# EasyEDA Pro project 半桥+驱动器.eprj

# Schematic Schematic1
Board Name: Board1; Create Date: 2025-04-12
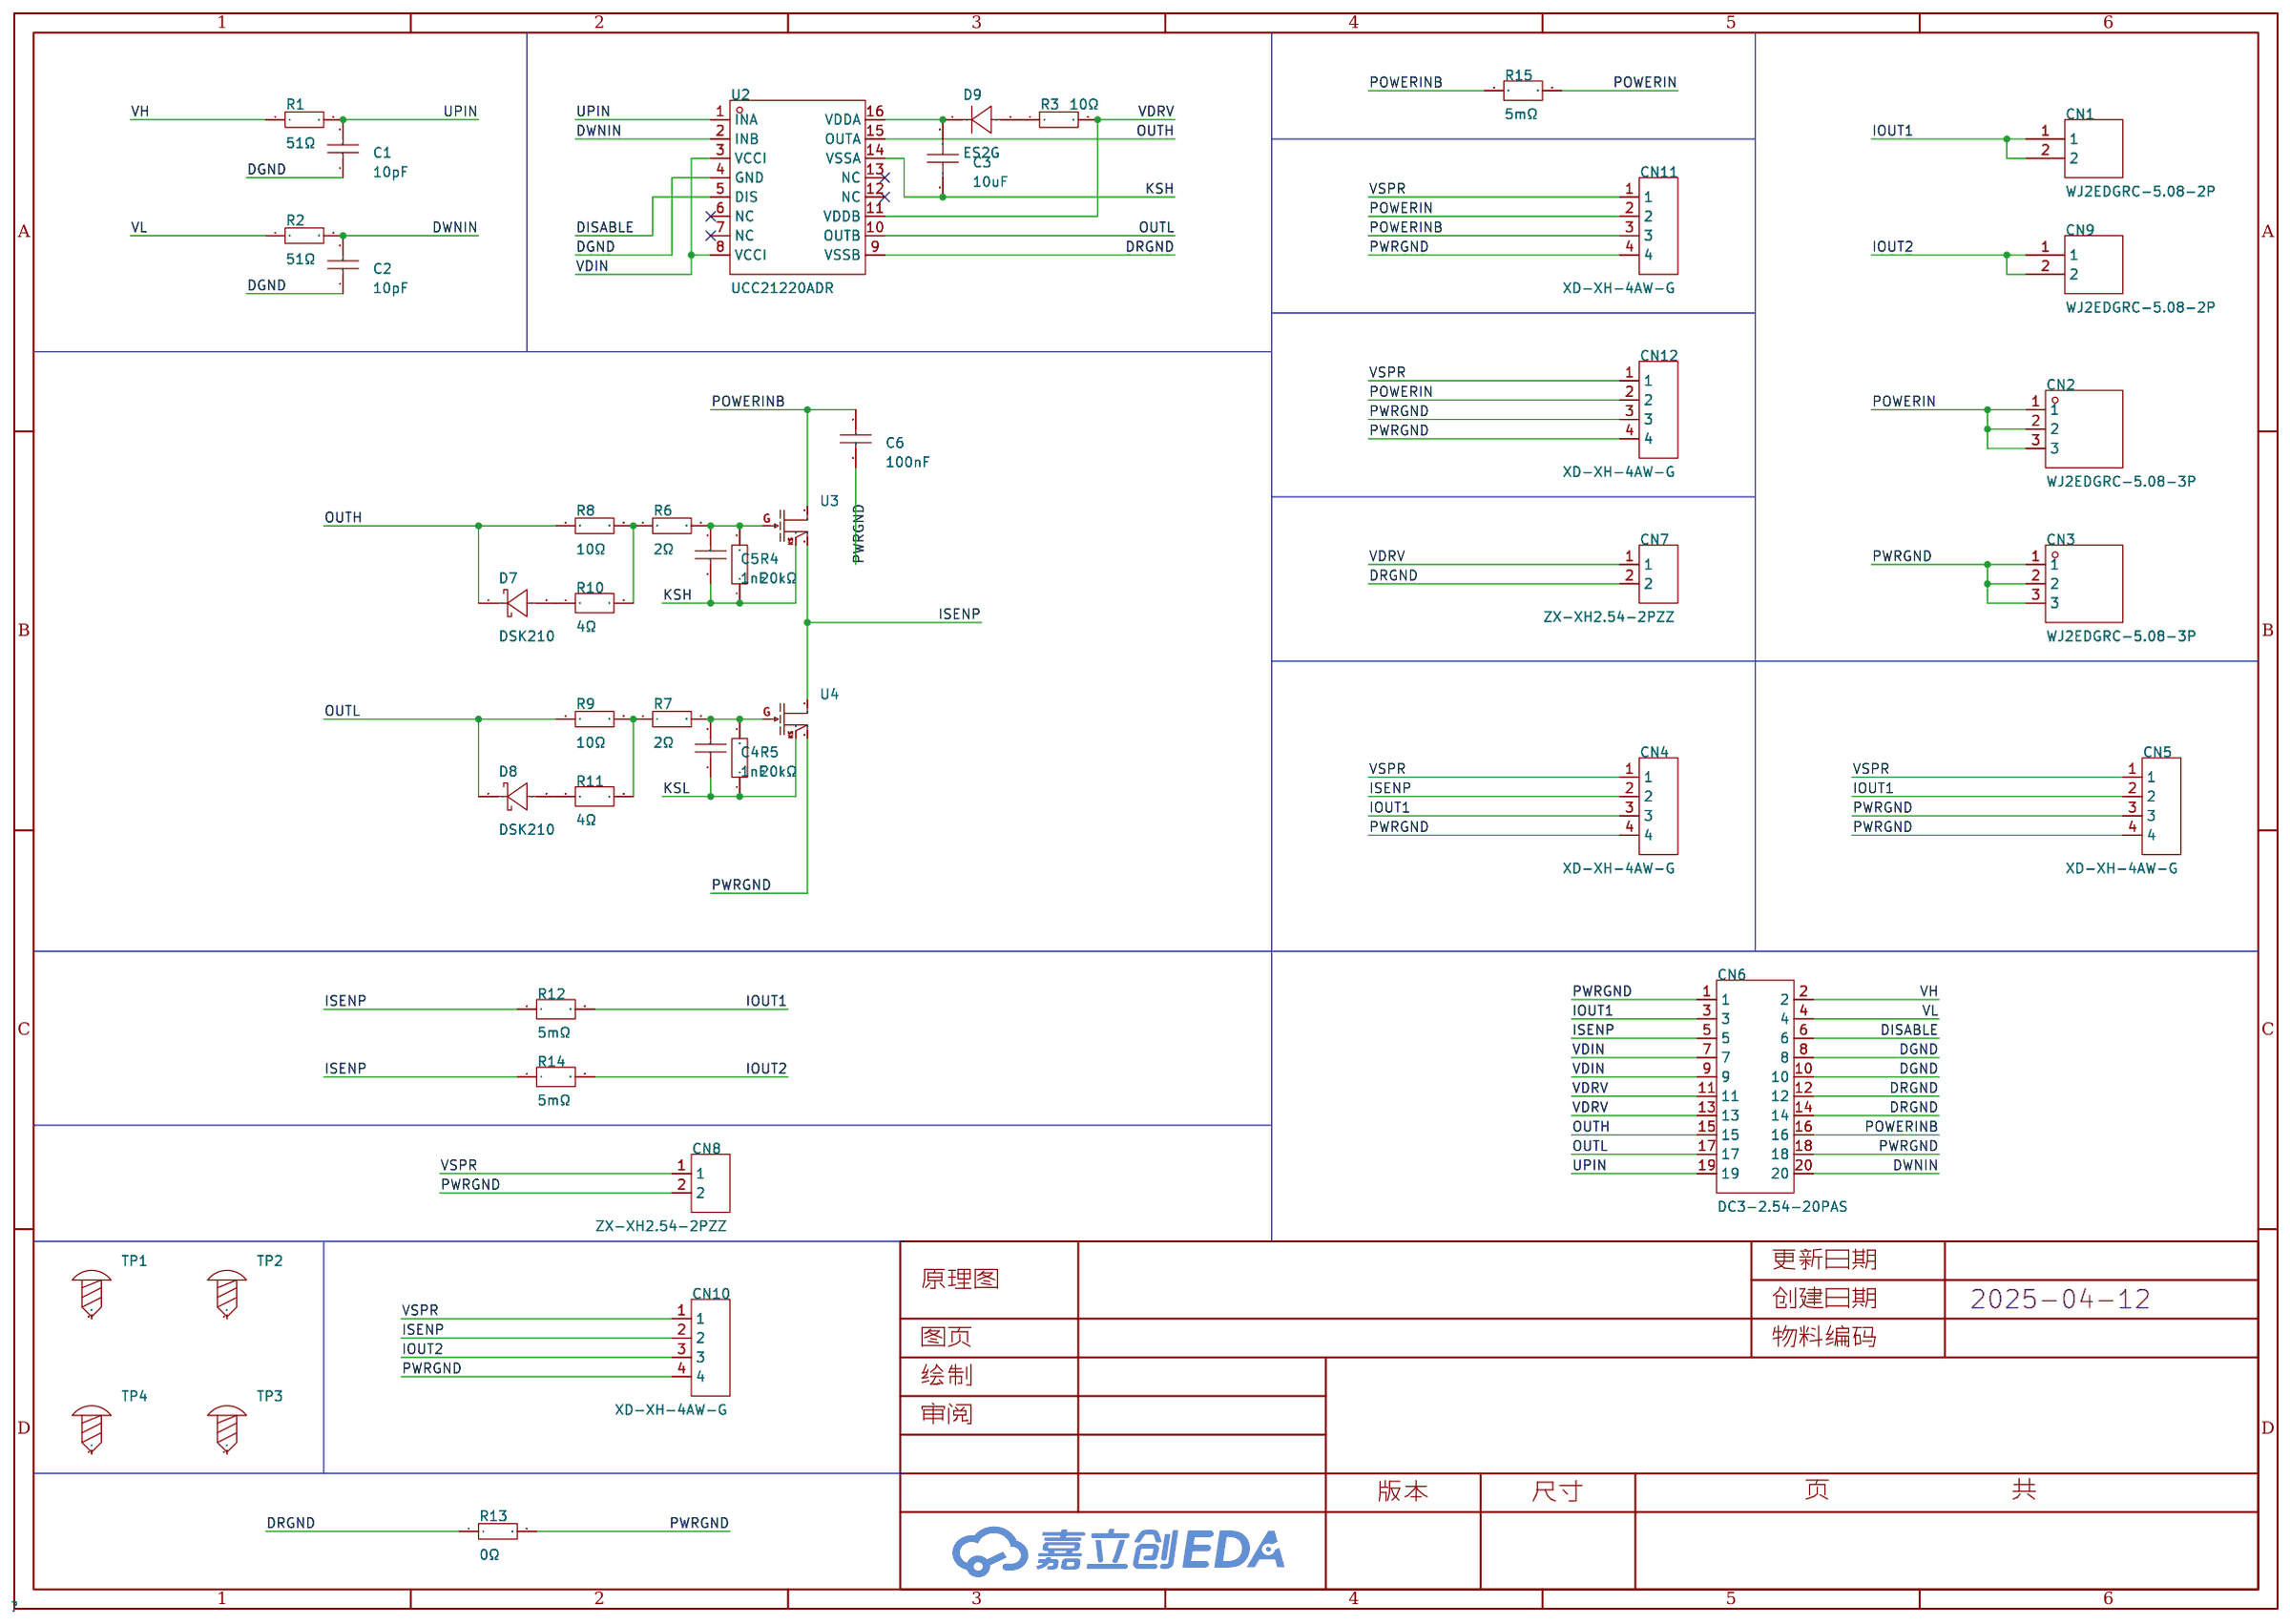
[diagram p0: schematic sheet]

## Parts
C1  10pF  [C0603]
C2  10pF  [C0603]
C3  10uF  [C0805]
C4  1nF  [C0603]
C5  1nF  [C0603]
C6  100nF  [C1210]
CN1  WJ2EDGRC-5.08-2P  [CONN-TH_2P-P5.08_WJ2EDGRC-5.08-2P]
CN2  WJ2EDGRC-5.08-3P  [CONN-TH_3P-P5.08_WJ2EDGRC-5.08-3P]
CN3  WJ2EDGRC-5.08-3P  [CONN-TH_3P-P5.08_WJ2EDGRC-5.08-3P]
CN4  XD-XH-4AW-G  [CONN-TH_XD-XH-4AW-G]
CN5  XD-XH-4AW-G  [CONN-TH_XD-XH-4AW-G]
CN6  DC3-2.54-20PAS  [HDR-TH_20P-P2.54_DC3-2.54-20PAS]
CN7  ZX-XH2.54-2PZZ  [CONN-TH_2P-P2.50_HX25003-2A]
CN8  ZX-XH2.54-2PZZ  [CONN-TH_2P-P2.50_HX25003-2A]
CN9  WJ2EDGRC-5.08-2P  [CONN-TH_2P-P5.08_WJ2EDGRC-5.08-2P]
CN10  XD-XH-4AW-G  [CONN-TH_XD-XH-4AW-G]
CN11  XD-XH-4AW-G  [CONN-TH_XD-XH-4AW-G]
CN12  XD-XH-4AW-G  [CONN-TH_XD-XH-4AW-G]
D7  DSK210  [SOD-123FL_L2.7-W1.8-LS3.8-RD]
D8  DSK210  [SOD-123FL_L2.7-W1.8-LS3.8-RD]
D9  ES2G  [SMA_L4.3-W2.6-LS5.0-RD]
R1  51Ω  [R0603]
R2  51Ω  [R0603]
R3  10Ω  [R0805_NEW]
R4  20kΩ  [R0603]
R5  20kΩ  [R0603]
R6  2Ω  [R0603]
R7  2Ω  [R0603]
R8  10Ω  [R0603]
R9  10Ω  [R0603]
R10  4Ω  [R0603]
R11  4Ω  [R0603]
R12  5mΩ  [RES-SMD_L6.4-W3.2-1]
R13  0Ω  [R0805]
R14  5mΩ  [RES-SMD_L6.4-W3.2-1]
R15  5mΩ  [RES-SMD_L6.4-W3.2-1]
TP1  -  [M3螺丝]
TP2  -  [M2螺丝]
TP3  -  [M2螺丝]
TP4  -  [M3螺丝]
U2  UCC21220ADR  [SOIC-16_L9.9-W3.9-P1.27-LS6.0-BL]
U3  -  [INN650TA030AH]
U4  -  [INN650TA030AH]

## Library data of the parts
C1 C2 = CC0603JRNPO9BN100: 容值:10pF;精度:±5%;额定电压:50V;材质(温度系数):NP0;; LCSC Part Name: 10pF ±5% 50V; Supplier Part: C106245; Manufacturer: YAGEO(国巨); Supplier Footprint: 0603; JLCPCB Part Class: 扩展库; Datasheet: https://atta.szlcsc.com/upload/public/pdf/source/20170505/1493957838062.pdf; Supplier: LCSC; Tolerance: ±5%; Voltage Rated: 50V; Temperature Coefficient: NP0
C3 = CL21A106KAYNNNE_C15850: 容值:10uF;精度:±10%;额定电压:25V;材质(温度系数):X5R;; LCSC Part Name: 10uF ±10% 25V; Supplier Part: C15850; Manufacturer: SAMSUNG(三星); Manufacturer Part: CL21A106KAYNNNE; Supplier Footprint: 0805; JLCPCB Part Class: 基础库; Datasheet: https://atta.szlcsc.com/upload/public/pdf/source/20160218/1457707763339.pdf; Supplier: LCSC; Tolerance: ±10%; Voltage Rated: 25V; Temperature Coefficient: X5R
C4 C5 = CL10B102KB8NNNC: LCSC Part Name: 1nF ±10% 50V; Supplier Part: C1588; Manufacturer: SAMSUNG(三星); Supplier Footprint: 0603; JLCPCB Part Class: 基础库; Datasheet: https://atta.szlcsc.com/upload/public/pdf/source/20160218/1457707763339.pdf; Supplier: LCSC; Tolerance: ±10%; Voltage Rated: 50V; Temperature Coefficient: X7R
C6 = C1210X104M351T: LCSC Part Name: 100nF ±20% 350V; Supplier Part: C106105; Manufacturer: IHHEC(禾伸堂); Supplier Footprint: 1210; JLCPCB Part Class: 扩展库; Datasheet: https://atta.szlcsc.com/upload/public/pdf/source/20200117/C485772_1C2A03D89DC7D3F931FB9AFBA2903E68.pdf; Supplier: LCSC; Tolerance: ±20%; Voltage Rating: 350V; Temperature Coefficient: X7R
CN1 CN9 = WJ2EDGRC-5.08-2P: 连接器类型:板端/插座-闭口;固定方式:-;结构:1x2P;间距:5.08mm;颜色:绿色;安装方式:弯针;排数:1;每排PIN数:2;额定电流:20A;额定电压:450V;线规 - AWG:-;线规 - 平方毫米:-;触头材质:黄铜;触头镀层:锡;工作温度范围:-40℃~+105℃;焊接温度(最大值):-;; LCSC Part Name: 1x2P 5.08mm 排数:1 每排P数:2; Supplier Part: C3697; Manufacturer: KANGNEX(康奈克斯电气); Supplier Footprint: 弯插,P=5.08mm; JLCPCB Part Class: 扩展库; Datasheet: https://atta.szlcsc.com/upload/public/pdf/source/20240813/4D8AF133EBD88DD18E5AA0CE5EC77AA3.pdf; Supplier: LCSC; Connector Type: 板端/插座-闭口; Structure: 1x2P; Pitch: 5.08mm; Color: 绿色; Mounting Style: 弯针; Number of Pins: 2P; Number of Rows: 1; Number of PINs Per Row: 2; Current Rating (Max): 20A; Voltage Rating (Max): 450V; Contact Material: 黄铜; Contact Plating: 锡; Operating Temperature Range: -40℃~+105℃
CN2 CN3 = WJ2EDGRC-5.08-3P: 连接器类型:板端/插座-闭口;固定方式:-;结构:1x3P;间距:5.08mm;颜色:绿色;安装方式:弯针;排数:1;每排PIN数:3;额定电流:20A;额定电压:450V;线规 - AWG:-;线规 - 平方毫米:-;触头材质:黄铜;触头镀层:锡;工作温度范围:-40℃~+105℃;焊接温度(最大值):-;; LCSC Part Name: 1x3P 5.08mm 排数:1 每排P数:3; Supplier Part: C8377; Manufacturer: KANGNEX(康奈克斯电气); Supplier Footprint: 弯插,P=5.08mm; JLCPCB Part Class: 扩展库; Datasheet: https://atta.szlcsc.com/upload/public/pdf/source/20240813/4D8AF133EBD88DD18E5AA0CE5EC77AA3.pdf; Supplier: LCSC; Connector Type: 板端/插座-闭口; Structure: 1x3P; Pitch: 5.08mm; Color: 绿色; Mounting Style: 弯针; Number of Pins: 3P; Number of Rows: 1; Number of PINs Per Row: 3; Current Rating (Max): 20A; Voltage Rating (Max): 450V; Contact Material: 黄铜; Contact Plating: 锡; Operating Temperature Range: -40℃~+105℃
CN4 CN5 CN10-CN12 = XD-XH-4AW-G: 插针结构:1x4P;间距:2.54mm;安装方式:弯插;参考系列:XH;总PIN数:4P;排数:1;每排PIN数:4;行距:2.54mm;额定电流:3A;工作温度:-25℃~+85℃;; LCSC Part Name: 1x4P 间距:2.54mm 弯插 系列:XH; Supplier Part: C17700963; Manufacturer: XUNDA(讯答); Supplier Footprint: 插件,P=2.5mm; JLCPCB Part Class: 扩展库; Datasheet: https://atta.szlcsc.com/upload/public/pdf/source/20231019/EDD688933EF3B2A2948A0AD0307CAFB3.pdf; Supplier: LCSC; Pins Structure: 1x4P; Pitch: 2.54mm; Mounting Type: 弯插; Reference Series: XH; Number of Pins: 4P; Number of Rows: 1; Number of PINs Per Row: 4; Row Spacing: 2.54mm; Current Rating: 3A; Operating Temperature: -25℃~+85℃
CN6 = DC3-2.54-20PAS: 连接器类型:简牛座;间距:2.54mm;结构:2x10P;额定电流:1.5A;额定电压:-;封装形式:直插;行距:2.54mm;排数:2;每排PIN数:10;工作温度范围:-40℃~+105℃;; LCSC Part Name: 2.54mm 2x10P 排数:2 每排P数:10; Supplier Part: C2977593; Manufacturer: ZHOURI(洲日); Supplier Footprint: 插件,P=2.54mm; JLCPCB Part Class: 扩展库; Datasheet: https://atta.szlcsc.com/upload/public/pdf/source/20220323/3AE71E35B6CB94868980D8F0E3C5785B.pdf; Supplier: LCSC; Connector Type: 简牛座; Pitch: 2.54mm; Structure: 2x10P; Current Rating (Max): 1.5A; Holder Type: 直插; Row Spacing: 2.54mm; Number of Rows: 2; Pin Number in each Row: 10; Operating Temperature Range: -40℃~+105℃
CN7 CN8 = ZX-XH2.54-2PZZ: 插针结构:1x2P;间距:2.5mm;安装方式:直插;参考系列:XH;总PIN数:2P;排数:1;每排PIN数:2;行距:-;额定电流:3A;触头材质:黄铜;触头镀层:锡;工作温度范围:-25℃~+85℃;; LCSC Part Name: 1x2P 间距:2.5mm 直插 系列:XH; Supplier Part: C7429632; Manufacturer: Megastar(兆星); Supplier Footprint: 插件,P=2.5mm; JLCPCB Part Class: 扩展库; Datasheet: https://atta.szlcsc.com/upload/public/pdf/source/20230619/19BA6947230AA44A04D3EDD65E618FD0.pdf; Supplier: LCSC; Pins Structure: 1x2P; Pitch: 2.5mm; Mounting Type: 直插; Reference Series: XH; Number of Pins: 2P; Number of Rows: 1; Number of PINs Per Row: 2; Rated Current: 3A; Contact Material: 黄铜; Contact Plating: 锡; Operating Temperature: -25℃~+85℃; Rated Voltage (Max): 250V; Plastic Material: PA66; Flame Retardant Rating: UL94V-0; Color: 白色; Z-Height of the Board: 7mm; X-Length of Bottom Edge on Board (Spacing Line): 7.5mm; Y-Width of Bottom Edge on Board: 5.9mm
D7 D8 = DSK210_C7502713: LCSC Part Name: 电压:100V 电流:2A; Supplier Part: C7502713; Manufacturer: 宏迦橙; Supplier Footprint: SOD-123FL; JLCPCB Part Class: 扩展库; Datasheet: https://atta.szlcsc.com/upload/public/pdf/source/20240814/18366EFEA8C1355349286254791BE851.pdf; Supplier: LCSC; Diode Configuration: 独立式; Forward Voltage (Vf@If): 850mV@2A; Reverse Voltage (Vr): 100V; Rectified Current: 2A; Reverse Leakage Current (Ir): 500uA
D9 = ES2G_C18199140: Supplier Part: C18199140; Manufacturer: 宏嘉诚; Supplier Footprint: SMA(DO-214AC); JLCPCB Part Class: 扩展库; Datasheet: https://atta.szlcsc.com/upload/public/pdf/source/20250205/BC13E6E0AE5DD1ED200D851F3F85D0E7.pdf; Supplier: LCSC; Diode Configuration: 独立式; Voltage - Forward(Vf@If): 1.3V@2A; Voltage - DC Reverse(Vr): 400V; Current - Rectified: 2A; Reverse Leakage Current (Ir): 2uA@400V; Reverse Recovery Time (trr): 35ns; Operating Temperature: -55℃~+150℃
R1 R2 = 0603WAF510JT5E: 电阻类型:厚膜电阻;阻值:51Ω;精度:±1%;功率:100mW;最大工作电压:75V;温度系数:±100ppm/℃;; LCSC Part Name: 51Ω ±1% 100mW 厚膜电阻; Supplier Part: C23197; Manufacturer: UNI-ROYAL(厚声); Supplier Footprint: 0603; JLCPCB Part Class: 基础库; Datasheet: https://atta.szlcsc.com/upload/public/pdf/source/20200306/C422600_1E6D84923E4A46A82E41ADD87F860B5C.pdf; Supplier: LCSC; Type: 厚膜电阻; Tolerance: ±1%; Power(Watts): 100mW; Overload Voltage (Max): 75V; Temperature Coefficient: ±100ppm/℃; Operating Temperature Range: -55℃~+155℃
R3 = 0805W8F100JT5E: 电阻类型:厚膜电阻;阻值:10Ω;精度:±1%;功率:125mW;最大工作电压:150V;温度系数:±200ppm/℃;; LCSC Part Name: 10Ω ±1% 125mW 厚膜电阻; Supplier Part: C17415; Manufacturer: UNI-ROYAL(厚声); Supplier Footprint: 0805; JLCPCB Part Class: 基础库; Datasheet: https://atta.szlcsc.com/upload/public/pdf/source/20200306/C422600_1E6D84923E4A46A82E41ADD87F860B5C.pdf; Supplier: LCSC; Type: 厚膜电阻; Tolerance: ±1%; Power(Watts): 125mW; Overload Voltage (Max): 150V; Temperature Coefficient: ±200ppm/℃; Operating Temperature Range: -55℃~+155℃
R4 R5 = 0603WAF2002T5E: 电阻类型:厚膜电阻;阻值:20kΩ;精度:±1%;功率:100mW;最大工作电压:75V;温度系数:±100ppm/℃;; LCSC Part Name: 20kΩ ±1% 100mW 厚膜电阻; Supplier Part: C4184; Manufacturer: UNI-ROYAL(厚声); Supplier Footprint: 0603; JLCPCB Part Class: 基础库; Datasheet: https://atta.szlcsc.com/upload/public/pdf/source/20200306/C422600_1E6D84923E4A46A82E41ADD87F860B5C.pdf; Supplier: LCSC; Type: 厚膜电阻; Tolerance: ±1%; Power(Watts): 100mW; Overload Voltage (Max): 75V; Temperature Coefficient: ±100ppm/℃; Operating Temperature Range: -55℃~+155℃
R6 R7 = 0603WAF200KT5E: 电阻类型:厚膜电阻;阻值:2Ω;精度:±1%;功率:100mW;最大工作电压:75V;温度系数:±200ppm/℃;; LCSC Part Name: 2Ω ±1% 100mW 厚膜电阻; Supplier Part: C22977; Manufacturer: UNI-ROYAL(厚声); Supplier Footprint: 0603; JLCPCB Part Class: 基础库; Datasheet: https://atta.szlcsc.com/upload/public/pdf/source/20200306/C422600_1E6D84923E4A46A82E41ADD87F860B5C.pdf; Supplier: LCSC; Type: 厚膜电阻; Tolerance: ±1%; Power(Watts): 100mW; Overload Voltage (Max): 75V; Temperature Coefficient: ±200ppm/℃; Operating Temperature Range: -55℃~+155℃
R8 R9 = 0603WAF100JT5E: 电阻类型:厚膜电阻;阻值:10Ω;精度:±1%;功率:100mW;最大工作电压:75V;温度系数:±400ppm/℃;; LCSC Part Name: 10Ω ±1% 100mW 厚膜电阻; Supplier Part: C22859; Manufacturer: UNI-ROYAL(厚声); Supplier Footprint: 0603; JLCPCB Part Class: 基础库; Datasheet: https://atta.szlcsc.com/upload/public/pdf/source/20200306/C422600_1E6D84923E4A46A82E41ADD87F860B5C.pdf; Supplier: LCSC; Type: 厚膜电阻; Tolerance: ±1%; Power(Watts): 100mW; Overload Voltage (Max): 75V; Temperature Coefficient: ±400ppm/℃; Operating Temperature Range: -55℃~+155℃
R10 R11 = CR164R00F: 电阻类型:厚膜电阻;阻值:4Ω;精度:±1%;功率:100mW;温度系数:±200ppm/℃;; LCSC Part Name: 厚膜电阻 4Ω ±1% 100mW; Supplier Part: C3942554; Manufacturer: Meritek; Supplier Footprint: 0603; JLCPCB Part Class: 扩展库; Datasheet: https://atta.szlcsc.com/upload/public/pdf/source/20240408/EFC32A6E0B04D07E4D8A435A440C47B4.pdf; Supplier: LCSC; Type: 厚膜电阻; Tolerance: ±1%; Power(Watts): 100mW; Temperature Coefficient: ±200ppm/℃; Operating Temperature: -55℃~+155℃
R12 R14 R15 = HoJLR2512-3W-5mR-1%: 电阻类型:采样电阻;阻值:5mΩ;精度:±1%;功率:3W;安装方式:贴片;; LCSC Part Name: 5mΩ ±1% 3W; Supplier Part: C2903482; Manufacturer: Milliohm(毫欧); Supplier Footprint: 2512; JLCPCB Part Class: 扩展库; Datasheet: https://atta.szlcsc.com/upload/public/pdf/source/20211009/7525CABAB363C979E942C1DD41F1FEF0.pdf; Supplier: LCSC; Type: 采样电阻; Tolerance: ±1%; Power(Watts): 3W; Mounting Sytle: 贴片
R13 = 0805W8F0000T5E: 电阻类型:厚膜电阻;阻值:0Ω;精度:±1%;功率:125mW;最大工作电压:150V;温度系数:±800ppm/℃;; LCSC Part Name: 0Ω ±1% 125mW 厚膜电阻; Supplier Part: C17477; Manufacturer: UNI-ROYAL(厚声); Supplier Footprint: 0805; JLCPCB Part Class: 基础库; Datasheet: https://atta.szlcsc.com/upload/public/pdf/source/20200306/C422600_1E6D84923E4A46A82E41ADD87F860B5C.pdf; Supplier: LCSC; Type: 厚膜电阻; Tolerance: ±1%; Power(Watts): 125mW; Overload Voltage (Max): 150V; Temperature Coefficient: ±800ppm/℃; Operating Temperature Range: -55℃~+155℃
TP1 TP4 = M3螺丝: Supplier Footprint: 插件
TP2 TP3 = M2螺丝: Supplier Footprint: 插件
U2 = UCC21220ADR: Supplier Part: C2878025; Manufacturer: TI(德州仪器); Supplier Footprint: SOIC-16; JLCPCB Part Class: 扩展库; Datasheet: https://www.ti.com/cn/lit/gpn/ucc21220; Supplier: LCSC
U3 U4 = INN650TA030AH

## Nets
DGND: C1.1 C2.1 CN6.8 CN6.10 U2.4(GND)
DISABLE: CN6.6 U2.5(DIS)
DRGND: CN6.12 CN6.14 CN7.2 R13.1 U2.9(VSSB)
DWNIN: C2.2 CN6.20 R2.2 U2.2(INB)
IOUT1: CN1.1 CN1.2 CN4.3 CN5.2 CN6.3 R12.2
IOUT2: CN9.1 CN9.2 CN10.3 R14.2
ISENP: CN4.2 CN6.5 CN10.2 R12.1 R14.1 U3.S(2) U4.D(1)
KSH: C3.1 C5.1 R4.1 U2.14(VSSA) U3.KS(2)
KSL: C4.1 R5.1 U4.KS(2)
OUTH: CN6.15 D7.1(K) R8.1 U2.15(OUTA)
OUTL: CN6.17 D8.1(K) R9.1 U2.10(OUTB)
POWERIN: CN2.1 CN2.2 CN2.3 CN11.2 CN12.2 R15.2
POWERINB: C6.2 CN6.16 CN11.3 R15.1 U3.D(1)
PWRGND: C6.1 CN3.1 CN3.2 CN3.3 CN4.4 CN5.3 CN5.4 CN6.1 CN6.18 CN8.2 CN10.4 CN11.4 CN12.3 CN12.4 R13.2 U4.S(2)
UPIN: C1.2 CN6.19 R1.2 U2.1(INA)
VDIN: CN6.7 CN6.9 U2.3(VCCI) U2.8(VCCI)
VDRV: CN6.11 CN6.13 CN7.1 R3.2 U2.11(VDDB)
VH: CN6.2 R1.1
VL: CN6.4 R2.1
VSPR: CN4.1 CN5.1 CN8.1 CN10.1 CN11.1 CN12.1
$1N1810: C3.2 D9.1(K) U2.16(VDDA)
$1N1849: C4.2 R5.2 R7.2 U4.G(2)
$1N1850: C5.2 R4.2 R6.2 U3.G(2)
$1N1851: R7.1 R9.2 R11.2
$1N1854: R6.1 R8.2 R10.2
$1N9211: D7.2(A) R10.1
$1N9248: D8.2(A) R11.1
$1N9324: D9.2(A) R3.1

Not connected (* = marked no-connect by the designer): TP1 1; TP2 1; TP3 1; TP4 1; U2 6(NC)* 7(NC)* 12(NC)* 13(NC)*

# Board PCB1
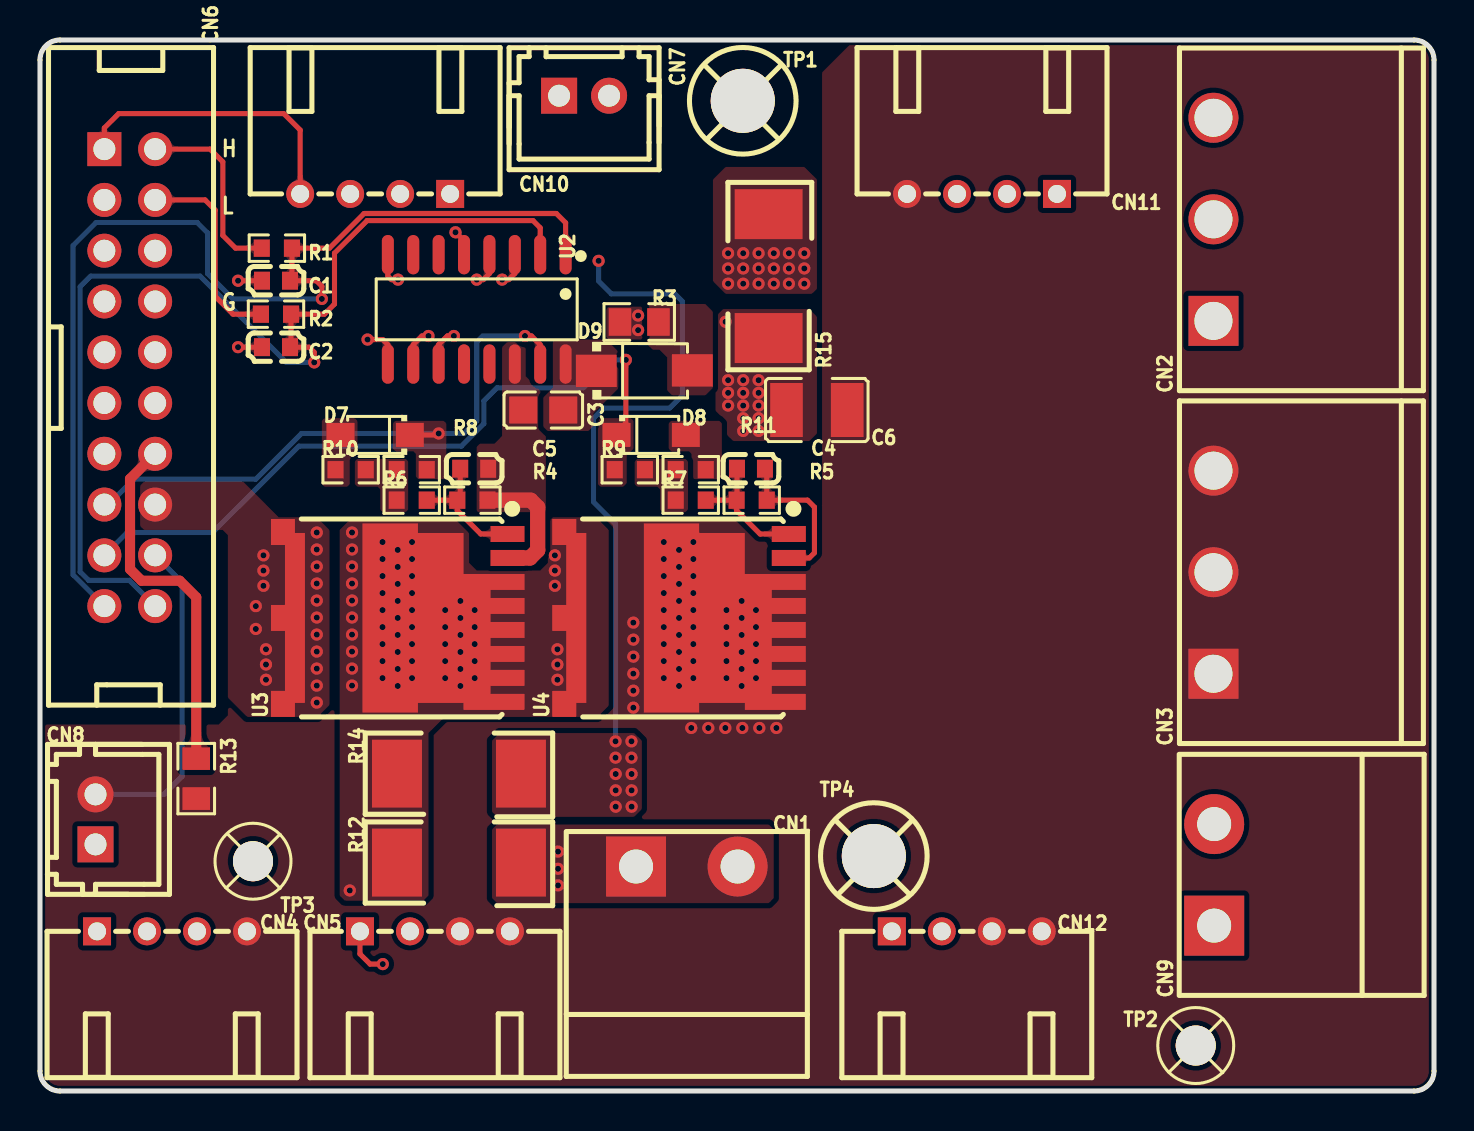
[diagram p1: board, top side]
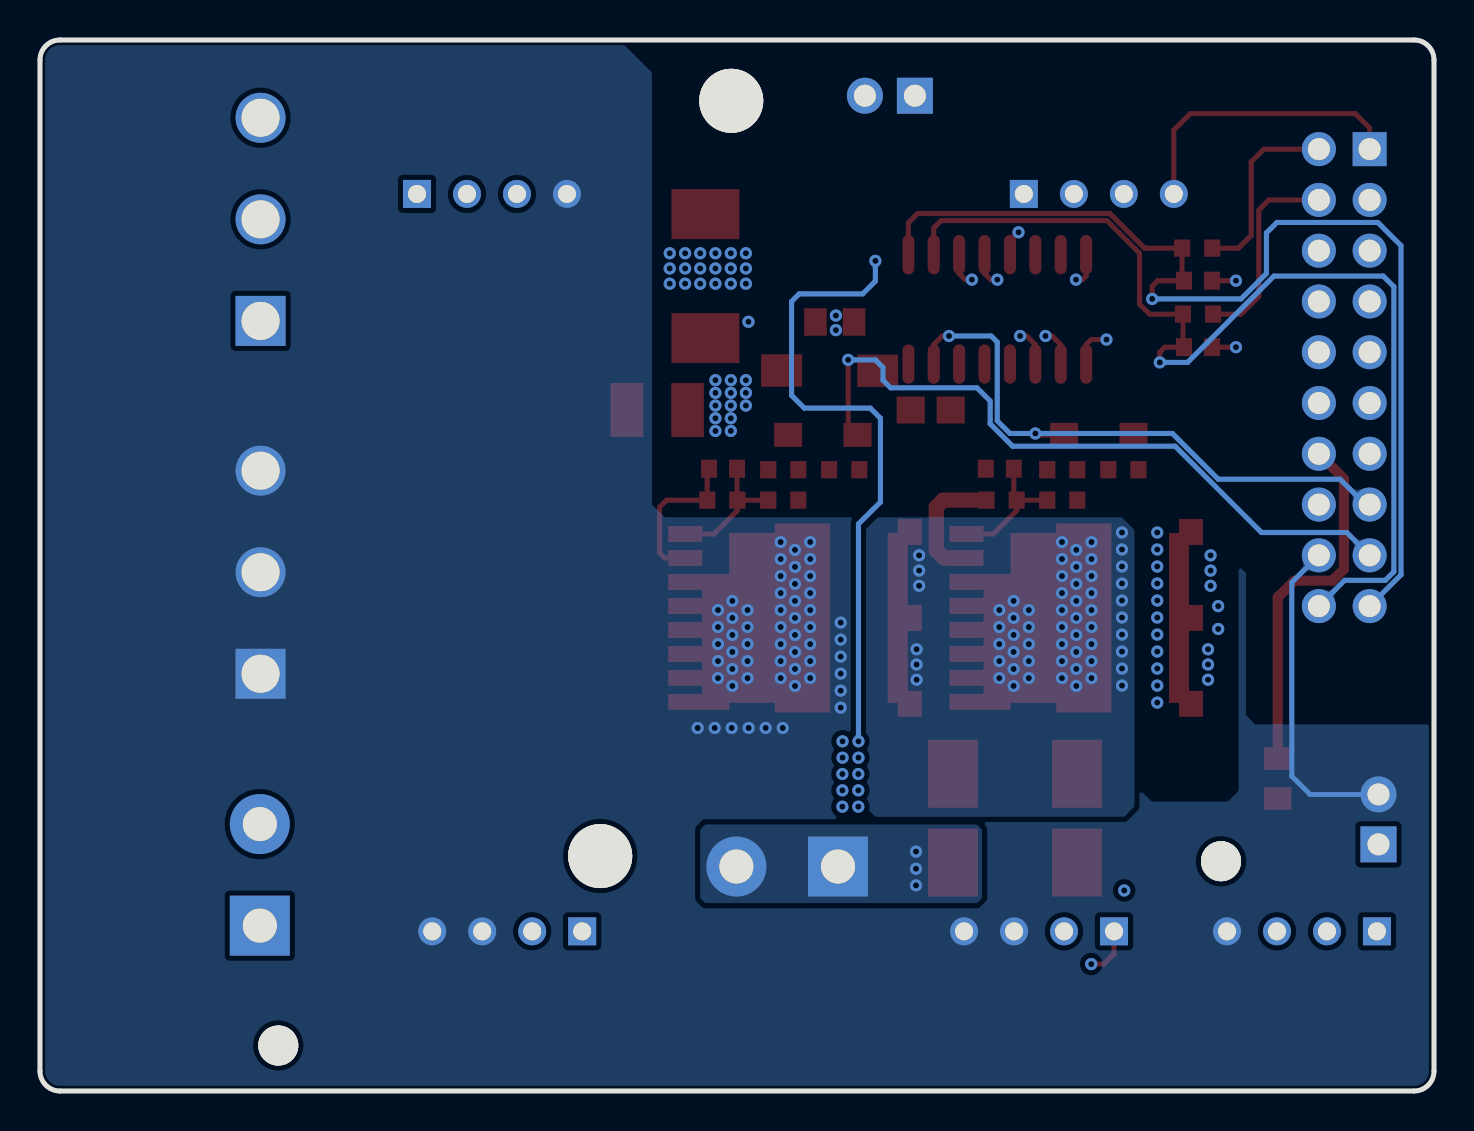
[diagram p2: board, bottom side, seen from below]

Outline 69.72 x 52.58 mm; copper layers: Top Layer, Inner1, Inner2, Bottom Layer. Coordinates in mm from the lower left corner of the outline.
Outline path: 0,51.58 0,1 arc(0.29,0.29) 1,0 68.72,0 arc(69.43,0.29) 69.72,1 69.72,51.58 arc(69.43,52.29) 68.72,52.58 1,52.58 arc(0.29,52.29) 0,51.58
Stack: Top Layer 0.035mm 外层铜厚1oz / Dielectric1 0.2104mm 7628 RC49% 8.6mil / Inner1 0.0152mm 内层铜厚 / Dielectric2 1.065mm 1.1mm H/HOZ Copper / Inner2 0.0152mm 内层铜厚 / Dielectric3 0.2104mm 7628 RC49% 8.6mil / Bottom Layer 0.035mm 外层铜厚1oz

## Design rules (mm)
template: 自定义配置
spacing copperThickness1oz: track to track 0.102, other pairs 0.152 to 0.3
spacing copperThickness2oz (default): track to track 0.102, other pairs 0.152 to 0.3
track width copperThickness1oz (default): min 0.127, default 0.254, max 2.54
track width copperThickness2oz: min 0.203, default 0.254, max 2.54
differential pair differentialPair (default): width min 0.127, default 0.254, max 2.54; gap min 0.152, default 0.152
via viaSize (default): diameter min 0.5, default 0.61, max 10; hole min 0.3, default 0.305, max 6.3
net DGND uses copperRegion1
net $1N1810 uses copperRegion1
net DRGND uses copperRegion1
net IOUT1 uses copperRegion1
net POWERIN uses copperRegion1
net PWRGND uses copperRegion1
net ISENP uses copperRegion1
net OUTL uses copperRegion1
net OUTH uses copperRegion1
net VDRV uses copperRegion1
net VDIN uses copperRegion1
net IOUT2 uses copperRegion1
net $1N1854 uses copperRegion1
net $1N1851 uses copperRegion1
net $1N9211 uses copperRegion1
net $1N9248 uses copperRegion1
net $1N9324 uses copperRegion1
net KSH uses copperRegion1
net POWERINB uses copperRegion1

## Placement (name value [footprint] x y rotation side)
C1  10pF  [C0603]  11.8 40.54 0 top
C2  10pF  [C0603]  11.8 37.21 0 top
C3  10uF  [C0805]  25.17 34.07 0 top
C4  1nF  [C0603]  35.56 31.13 180 top
C5  1nF  [C0603]  21.72 31.13 180 top
C6  100nF  [C1210]  38.85 34.07 180 top
CN1  WJ2EDGRC-5.08-2P  [CONN-TH_2P-P5.08_WJ2EDGRC-5.08-2P]  32.35 11.23 0 top
CN2  WJ2EDGRC-5.08-3P  [CONN-TH_3P-P5.08_WJ2EDGRC-5.08-3P]  58.69 43.61 90 top
CN3  WJ2EDGRC-5.08-3P  [CONN-TH_3P-P5.08_WJ2EDGRC-5.08-3P]  58.69 25.95 90 top
CN4  XD-XH-4AW-G  [CONN-TH_XD-XH-4AW-G]  6.6 7.99 0 top
CN5  XD-XH-4AW-G  [CONN-TH_XD-XH-4AW-G]  19.75 7.99 0 top
CN6  DC3-2.54-20PAS  [HDR-TH_20P-P2.54_DC3-2.54-20PAS]  4.49 35.69 270 top
CN7  ZX-XH2.54-2PZZ  [CONN-TH_2P-P2.50_HX25003-2A]  27.21 49.79 0 top
CN8  ZX-XH2.54-2PZZ  [CONN-TH_2P-P2.50_HX25003-2A]  2.78 13.59 90 top
CN9  WJ2EDGRC-5.08-2P  [CONN-TH_2P-P5.08_WJ2EDGRC-5.08-2P]  58.73 10.81 90 top
CN10  XD-XH-4AW-G  [CONN-TH_XD-XH-4AW-G]  16.76 44.88 180 top
CN11  XD-XH-4AW-G  [CONN-TH_XD-XH-4AW-G]  47.12 44.88 180 top
CN12  XD-XH-4AW-G  [CONN-TH_XD-XH-4AW-G]  46.35 7.99 0 top
D7  DSK210  [SOD-123FL_L2.7-W1.8-LS3.8-RD]  16.76 32.82 180 top
D8  DSK210  [SOD-123FL_L2.7-W1.8-LS3.8-RD]  30.57 32.82 0 top
D9  ES2G  [SMA_L4.3-W2.6-LS5.0-RD]  30.23 36.04 0 top
R1  51Ω  [R0603]  11.85 42.16 0 top
R2  51Ω  [R0603]  11.8 38.86 0 top
R3  10Ω  [R0805_NEW]  29.97 38.47 180 top
R4  20kΩ  [R0603]  21.63 29.56 180 top
R5  20kΩ  [R0603]  35.6 29.56 180 top
R6  2Ω  [R0603]  18.59 29.56 0 top
R7  2Ω  [R0603]  32.55 29.56 0 top
R8  10Ω  [R0603]  18.59 31.08 180 top
R9  10Ω  [R0603]  29.5 31.08 0 top
R10  4Ω  [R0603]  15.54 31.08 0 top
R11  4Ω  [R0603]  32.55 31.08 180 top
R12  5mΩ  [RES-SMD_L6.4-W3.2-1]  20.96 11.43 0 top
R13  0Ω  [R0805]  7.81 15.63 270 top
R14  5mΩ  [RES-SMD_L6.4-W3.2-1]  20.96 15.88 0 top
R15  5mΩ  [RES-SMD_L6.4-W3.2-1]  36.44 40.77 90 top
TP1  -  [M3螺丝]  35.21 49.47 0 top
TP2  -  [M2螺丝]  57.81 2.28 0 top
TP3  -  [M2螺丝]  10.65 11.5 0 top
TP4  -  [M3螺丝]  41.77 11.69 0 top
U2  UCC21220ADR  [SOIC-16_L9.9-W3.9-P1.27-LS6.0-BL]  21.84 39.1 180 top
U3  -  [INN650TA030AH]  11.55 23.67 90 top
U4  -  [INN650TA030AH]  25.62 23.67 90 top

## Footprints (pads in the part's own frame, mm; a bottom-side part is the same pattern mirrored in y, then rotated)
C0603
  rect 0.8x0.9 smd: 1(-0.7,0) 2(0.7,0)
C0805
  rect 1.41x1.35 smd: 1(-1,0) 2(1,0)
C1210
  rect 1.635x2.7 smd: 1(-1.518,0) 2(1.518,0)
CONN-TH_2P-P2.50_HX25003-2A
  rect 1.8x1.8 hole 1.1: 1(-1.25,0)
  round 1.8 hole 1.1: 2(1.25,0)
CONN-TH_2P-P5.08_WJ2EDGRC-5.08-2P
  rect 3x3 hole 1.7: 1(-2.54,0)
  round 3 hole 1.7: 2(2.54,0)
CONN-TH_3P-P5.08_WJ2EDGRC-5.08-3P
  rect 2.5x2.5 hole 1.9: 1(-5.08,0)
  round 2.5 hole 1.9: 2(0,0) 3(5.08,0)
CONN-TH_XD-XH-4AW-G
  rect 1.4x1.4 hole 0.9: 1(-3.75,0)
  round 1.4 hole 0.9: 2(-1.25,0) 3(1.25,0) 4(3.75,0)
HDR-TH_20P-P2.54_DC3-2.54-20PAS
  rect 1.7x1.7 hole 1.1: 1(-11.43,-1.27)
  round 1.7 hole 1.1: 2(-11.43,1.27) 3(-8.89,-1.27) 4(-8.89,1.27) 5(-6.35,-1.27) 6(-6.35,1.27) 7(-3.81,-1.27) 8(-3.81,1.27) 9(-1.27,-1.27) 10(-1.27,1.27) 11(1.27,-1.27) 12(1.27,1.27) 13(3.81,-1.27) 14(3.81,1.27) 15(6.35,-1.27) 16(6.35,1.27) 17(8.89,-1.27) 18(8.89,1.27) 19(11.43,-1.27) 20(11.43,1.27)
INN650TA030AH
  custom 9.9x1.7 smd: D(0,-0.85)
  custom 0.8x1.7 smd: G(4.2,-11.83) KS(3,-11.83)
  custom 9.46x8.1 smd: S(0,-7.78)
M2螺丝
  round 2 hole 2: 1(0,0)
M3螺丝
  round 3.2 hole 3.2: 1(-0.064,0.064)
R0603
  rect 0.806x0.864 smd: 1(-0.753,0) 2(0.753,0)
R0805
  rect 1.133x1.377 smd: 1(-1,0) 2(1,0)
R0805_NEW
  rect 1.133x1.377 smd: 1(-0.966,0) 2(0.966,0)
RES-SMD_L6.4-W3.2-1
  rect 2.5x3.4 smd: 1(-3.1,0) 2(3.1,0)
SMA_L4.3-W2.6-LS5.0-RD
  rect 2.046x1.62 smd: 1(-2.404,-0.009) 2(2.404,0.009)
SOD-123FL_L2.7-W1.8-LS3.8-RD
  rect 1.4x1.2 smd: 1(-1.735,0) 2(1.735,0)
SOIC-16_L9.9-W3.9-P1.27-LS6.0-BL
  oval 0.602x1.971 smd: 1(-4.445,-2.736) 2(-3.175,-2.736) 3(-1.905,-2.736) 4(-0.635,-2.736) 5(0.635,-2.736) 6(1.905,-2.736) 7(3.175,-2.736) 8(4.445,-2.736) 9(4.445,2.736) 10(3.175,2.736) 11(1.905,2.736) 12(0.635,2.736) 13(-0.635,2.736) 14(-1.905,2.736) 15(-3.175,2.736) 16(-4.445,2.736)

## Nets
As in the schematic.

Pads without a net: TP1 1; TP2 1; TP3 1; TP4 1; U2 6 7 12 13

## Via types
v1: diameter 0.61, hole 0.305, Top Layer to Bottom Layer, 197 vias

## Routing (per net, layer and track width the routed paths; a pad name or vN(x,y) marks a point on that pad's centre or on a via; arc(x,y) is an arc through that point)
DGND: length 4.1
  Top Layer w0.254: C2.1 v1(9.91,37.21) ; v1(21.84,40.59) 22.17,40.59 22.48,40.89 U2.4 ; C1.1 v1(9.91,40.54)
DISABLE: length 17.1
  Top Layer w0.254: U2.5 21.21,42.53 v1(20.78,42.96)
  Inner2 w0.254: CN6.6 7.11,42.04 8.51,43.43 20.31,43.43 v1(20.78,42.96)
DRGND: length 20.3
  Top Layer w0.254: U2.9 17.4,37.34 17.15,37.59 v1(16.38,37.59)
  Top Layer w0.508: CN6.14 4.5,30.62 4.5,26.1 5.08,25.53 6.98,25.53 7.81,24.7 R13.1
DWNIN: length 53.3
  Top Layer w0.254: U2.2 25.02,43.18 24.66,43.54 16.36,43.54 14.73,41.91 14.73,39.37 14.22,38.86 R2.2 12.56,37.26 C2.2 13.46,37.21 13.72,36.96 v1(13.72,36.45)
  Bottom Layer w0.254: CN6.20 4.47,25.55 2.43,25.55 2.01,25.97 2.01,40.23 2.54,40.77 8.01,40.77 12.32,36.45 v1(13.72,36.45)
IOUT1: length 70.3
  Inner2 w0.254: CN6.3 0.64,41.99 0.64,7.65 1.63,6.65 6.53,6.65 7.85,7.98 CN4.3 8.86,6.98 17.5,6.98 CN5.2 19.79,9.27 27.85,9.27 CN1.1
  vias: v1(25.91,11.98) v1(25.91,11.12) v1(25.91,10.29)
IOUT2: length 49.3
  Inner2 w0.254: v1(27.94,41.53) 27.94,43.56 27.71,43.79 19.56,43.79 19.18,44.17 19.18,45.71 18.79,46.1 15.87,46.1 15.51,45.74 CN10.3
  Bottom Layer w0.254: 29.62,17.53 v1(29.58,17.49) ; v1(27.94,41.53) 27.94,40.51 28.57,39.88 31.75,39.88 32.13,39.5 32.13,34.8 31.5,34.16 28.19,34.16 27.69,33.66 27.69,29.46 28.79,28.36 v1(28.79,17.49)
  vias: v1(28.79,16.68) v1(28.79,15.86) v1(28.79,15.04) v1(28.79,14.22) v1(29.58,16.68) v1(29.59,15.86) v1(29.59,15.04) v1(29.59,14.22)
ISENP: length 63.9
  Inner2 w0.254: CN10.2 18.01,44.34 18.03,44.32 18.03,44.07 17.75,43.79 8.36,43.79 7.74,43.17 4.35,43.17 CN6.5 1.4,40.21 1.4,21.59 5.35,17.63 CN4.2 5.83,7.99 7.24,9.4 14.86,9.4 v1(15.49,10.03)
  vias: v1(15.61,27.94) v1(15.61,27.09) v1(15.61,26.24) v1(15.61,25.39) v1(15.61,24.54) v1(15.61,23.69) v1(15.61,22.83) v1(15.61,21.98) v1(15.61,21.13) v1(15.61,20.28) v1(17.13,27.46) v1(17.13,26.61) v1(17.13,25.76) v1(17.13,24.91) v1(17.13,24.06) v1(17.13,23.21) v1(17.13,22.36) v1(17.13,21.51) v1(17.13,20.66) v1(17.89,27.07) v1(17.89,26.22) v1(17.89,25.37) v1(17.89,24.52) v1(17.89,23.67) v1(17.89,22.81) v1(17.89,21.96) v1(17.89,21.11) v1(17.89,20.26) v1(18.61,27.46) v1(18.61,26.61) v1(18.61,25.76) v1(18.61,24.91) v1(18.61,24.06) v1(18.61,23.21) v1(18.61,22.36) v1(18.61,21.51) v1(18.61,20.66) v1(20.27,24.06) v1(20.27,23.21) v1(20.27,22.36) v1(20.27,21.51) v1(20.27,20.66) v1(21.03,24.52) v1(21.03,23.67) v1(21.03,22.81) v1(21.03,21.96) v1(21.03,21.11) v1(21.03,20.26) v1(21.74,24.06) v1(21.74,23.21) v1(21.74,22.36) v1(21.74,21.51) v1(21.74,20.66) v1(25.75,26.8) v1(25.75,26.03) v1(25.75,25.27) v1(25.88,22.1) v1(25.88,21.34) v1(25.88,20.57)
KSH: length 6.5
  Top Layer w0.254: 22.42,29.59 R4.1
  Top Layer w0.762: R4.1 24.54,29.56 24.89,29.21 24.89,27.05 24.51,26.67 U3.KS
KSL: length 7.8
  Top Layer w0.254: U4.KS 38.48,26.67 38.74,26.92 38.74,29.21 38.39,29.56 R5.1 36.35,31.04 C4.1
OUTH: length 30.2
  Top Layer w0.254: v1(24.26,37.77) 24.59,37.77 25.02,37.34 U2.15 ; v1(19.94,32.89) 19.87,32.82 D7.1
  Bottom Layer w0.254: CN6.15 3.43,29.34 4.7,30.61 10.8,30.61 13.08,32.89 v1(19.94,32.89) 21.21,32.89 21.84,33.53 21.84,37.47 22.15,37.77 v1(24.26,37.77)
OUTL: length 47.7
  Top Layer w0.254: v1(29.3,36.58) 29.3,33.42 28.74,32.86 ; U2.10 18.67,37.34 19.1,37.77 v1(19.43,37.77)
  Inner1 w0.254: v1(19.43,37.77) 19.89,37.77 20.12,37.54 20.12,37.53 20.46,37.19 29.11,37.19 29.3,36.99 v1(29.3,36.58)
  Bottom Layer w0.254: v1(29.3,36.58) 27.94,36.58 27.56,36.2 27.56,35.56 27.18,35.18 22.86,35.18 22.2,34.52 22.2,33.38 21.08,32.26 12.95,32.26 8.63,27.94 4.36,27.94 CN6.17
POWERIN: length 63.1
  Inner2 w0.254: CN11.2 49.64,43.61 CN2.2 ; CN2.1 61.59,35.62 61.59,6.6 60.32,5.33 45.97,5.33 45.1,6.2 CN12.2
  vias: v1(34.42,41.91) v1(34.42,41.15) v1(34.42,40.39) v1(35.17,41.91) v1(35.17,41.15) v1(35.17,40.39) v1(35.94,41.91) v1(35.94,41.15) v1(35.94,40.39) v1(36.7,41.91) v1(36.7,41.15) v1(36.7,40.39) v1(37.46,41.91) v1(37.46,41.15) v1(37.46,40.39) v1(38.23,41.91) v1(38.23,41.15) v1(38.23,40.39)
POWERINB: length 23
  Inner2 w0.254: CN11.3 43.75,46.99 33.4,46.99 33.02,46.61 33.02,38.99 33.53,38.48 v1(34.29,38.48)
  vias: v1(10.8,24.26) v1(10.8,23.11) v1(11.18,26.8) v1(11.18,26.03) v1(11.18,25.27) v1(11.3,22.1) v1(11.3,21.34) v1(11.3,20.57) v1(13.84,27.94) v1(13.84,27.09) v1(13.84,26.24) v1(13.84,25.39) v1(13.84,24.54) v1(13.84,23.69) v1(13.84,22.83) v1(13.84,21.98) v1(13.84,21.13) v1(13.84,20.28) v1(13.84,19.43) v1(34.42,35.56) v1(34.42,34.92) v1(34.42,34.29) v1(35.17,35.56) v1(35.17,34.92) v1(35.17,34.29) v1(35.17,33.66) v1(35.17,33.02) v1(35.94,35.56) v1(35.94,34.92) v1(35.94,34.29) v1(35.94,33.66) v1(35.94,33.02)
PWRGND: length 58.1
  Top Layer w0.254: CN6.1 3.22,48.18 3.94,48.9 12.19,48.9 13.01,48.07 CN10.4
  Inner1 w0.254: CN6.1 1.27,47.12 0.43,46.27 0.43,28.32 0.68,28.07 3.56,28.07 4.83,26.8 CN6.18
  Bottom Layer w0.254: CN6.18 7.11,25.44 7.11,15.75 6.2,14.84 CN8.2
  vias: v1(29.68,23.43) v1(29.68,22.58) v1(29.68,21.73) v1(29.68,20.88) v1(29.68,20.03) v1(29.68,19.18) v1(31.2,27.46) v1(31.2,26.61) v1(31.2,25.76) v1(31.2,24.91) v1(31.2,24.06) v1(31.2,23.21) v1(31.2,22.36) v1(31.2,21.51) v1(31.2,20.66) v1(31.96,27.07) v1(31.96,26.22) v1(31.96,25.37) v1(31.96,24.52) v1(31.96,23.67) v1(31.96,22.81) v1(31.96,21.96) v1(31.96,21.11) v1(31.96,20.26) v1(32.58,18.16) v1(32.68,27.46) v1(32.68,26.61) v1(32.68,25.76) v1(32.68,24.91) v1(32.68,24.06) v1(32.68,23.21) v1(32.68,22.36) v1(32.68,21.51) v1(32.68,20.66) v1(33.43,18.16) v1(34.33,24.06) v1(34.33,23.21) v1(34.33,22.36) v1(34.33,21.51) v1(34.33,20.66) v1(34.28,18.16) v1(35.1,24.52) v1(35.1,23.67) v1(35.1,22.81) v1(35.1,21.96) v1(35.1,21.11) v1(35.1,20.26) v1(35.13,18.16) v1(35.81,24.06) v1(35.81,23.21) v1(35.81,22.36) v1(35.81,21.51) v1(35.81,20.66) v1(35.98,18.16) v1(36.83,18.16)
UPIN: length 54.6
  Top Layer w0.254: v1(14.1,39.62) 14.1,40.26 13.82,40.54 C1.2 12.6,40.63 12.6,42.16 14.48,42.16 16.21,43.9 25.82,43.9 26.29,43.43 U2.1
  Bottom Layer w0.254: CN6.19 1.65,25.83 1.65,42.29 2.81,43.45 7.86,43.45 8.38,42.93 8.38,40.89 9.65,39.62 v1(14.1,39.62)
VDIN: length 3.4
  Top Layer w0.254: U2.3 23.75,40.89 23.44,40.59 v1(23.11,40.59) ; v1(17.91,40.59) 17.58,40.59 17.4,40.77 U2.8
VDRV: length 1.9
  Top Layer w0.254: U2.11 19.94,37.34 20.37,37.77 v1(20.7,37.77)
  vias: v1(29.91,38.79) v1(29.91,38.06)
VH: length 9.5
  Top Layer w0.254: R1.1 9.78,42.16 9.14,42.8 9.14,46.48 8.51,47.12 CN6.2
VL: length 10.2
  Top Layer w0.254: CN6.4 8.25,44.58 8.76,44.07 8.76,39.75 9.65,38.86 R2.1
VSPR: length 143.4
  Top Layer w0.254: v1(17.15,6.35) 16.51,6.35 16,6.86 CN5.1
  Inner2 w0.254: CN12.1 40.97,6.35 v1(17.15,6.35) ; CN11.1 50.87,50.73 50.04,51.56 22.86,51.56 22.1,50.8 22.1,45.47 21.51,44.88 CN10.1 18.91,46.48 8.25,46.48 7.76,45.99 5.22,45.99 4.45,45.21 4.45,43.94 3.95,43.45 3.03,43.45 2.09,42.5 2.09,42.48 0.99,41.38 0.99,14.12 CN8.1 2.78,10.3 2.85,10.23 CN4.1 3.83,7.01 5.76,7.01 6.33,7.58 6.33,7.99 7.39,9.04 14.95,9.04 CN5.1
$1N1849: length 6.7
  Top Layer w0.254: C4.2 34.86,29.57 34.84,29.56 ; 34.84,29.56 34.84,29.04 36.02,27.87 U4.G ; 34.84,29.56 R7.2
$1N1850: length 6.7
  Top Layer w0.254: R4.2 20.87,29.04 22.05,27.87 U3.G ; R4.2 R6.2 ; R4.2 21.02,29.7 C5.2

## Copper pours and planes (outline as drawn; the poured copper is in the pictures)
DGND on Inner1: 4.52,40.22 4.81,40.51 7.62,40.51 10.16,43.05 26.92,43.05 27.18,42.8 27.18,40.51 27.05,40.39 14.47,40.39 9.91,35.82 9.91,35.81 4.81,35.81 4.52,36.11
DRGND on Inner1: 4.52,35.25 4.83,35.56 13.59,35.56 16,37.97 27.83,37.97 28.32,38.47 28.32,45.08 27.58,45.83 23.77,45.83 23.24,46.36 23.24,51.69 23.74,52.19 32.14,52.19 32.64,51.69 32.64,34.77 31.9,34.04 18.8,34.04 14.99,30.23 4.9,30.23 4.52,30.61
IOUT1 on Top Layer: 22.61,13.08 22.86,13.34 36.45,13.34 36.7,13.08 36.7,9.65 36.45,9.4 22.86,9.4 22.61,9.65
IOUT1 on Bottom Layer: 22.61,13.08 22.86,13.34 36.45,13.34 36.7,13.08 36.7,9.65 36.45,9.4 22.86,9.4 22.61,9.65
IOUT2 on Top Layer: 22.61,17.53 22.99,17.91 29.72,17.91 30.1,17.53 30.1,14.1 29.72,13.72 22.86,13.72 22.61,13.97
IOUT2 on Inner2: 28.32,17.78 60.39,17.78 61.33,16.84 61.33,6.72 60.2,5.59 54.61,5.59 53.34,6.86 53.34,11.05 50.67,13.72 28.45,13.72 28.19,13.97 28.19,17.65
ISENP on Top Layer: 14.99,28.07 15.53,28.62 20.91,28.62 21.46,28.07 21.46,26.42 21.84,26.03 25.02,26.03 25.4,26.42 25.4,28.45 25.65,28.7 27.81,28.7 28.45,28.07 28.45,19.28 27.88,18.72 20.24,18.72 19.43,17.91 19.43,9.78 19.18,9.53 15.24,9.53 14.99,9.78
ISENP on Bottom Layer: 28.45,14.22 27.94,13.72 15.49,13.72 14.99,14.22 14.99,28.07 15.62,28.7 27.81,28.7 28.45,28.07
KSH on Top Layer: 23.11,37.21 23.37,37.47 24.02,37.47 24.29,37.19 24.29,35.75 25.3,34.75 25.3,26.57 24.89,26.16 22.35,26.16 22.1,26.42 22.1,26.92 22.35,27.18 24.26,27.18 24.38,27.31 24.38,28.32 24.26,28.45 22.22,28.45 21.84,28.83 21.84,32.23 22,32.38 22.73,32.38 23.11,32.77
OUTH on Top Layer: 17.65,33.4 17.78,33.53 20.19,33.53 20.32,33.4 20.32,30.73 20.19,30.61 18.92,30.61 18.8,30.73 18.8,31.88 18.67,32 17.78,32 17.65,32.13
OUTL on Top Layer: 29.35,31.79 29.68,32.13 29.68,33.53 29.56,33.66 28.03,33.66 27.91,33.53 27.91,30.35 28.03,30.23 29.18,30.23 29.35,30.4
POWERIN on Top Layer: 33.66,45.59 34.29,46.23 38.23,46.23 38.86,45.59 38.86,40.13 38.61,39.88 34.29,39.88 33.66,40.51
POWERIN on Bottom Layer: 14.48,28.06 13.93,28.62 10.84,28.62 10.03,27.81 10.03,15.11 10.41,14.73 14.01,14.73 14.48,15.2
POWERIN on Inner2: 60.83,49.66 59.69,50.8 55.75,50.8 55.12,50.17 55.12,44.32 54.1,43.31 41.15,43.31 40,44.45 40,45.59 39.37,46.23 34.29,46.23 33.66,45.59 33.66,40.51 34.29,39.88 54.1,39.88 55.12,38.86 55.12,36.83 56.01,35.94 60.2,35.94 60.83,36.58
POWERINB on Top Layer: 4.7,29.97 5.21,30.48 10.16,30.48 11.94,28.7 13.84,28.7 14.48,28.07 14.48,19.31 13.89,18.72 10.37,18.72 9.4,19.69 9.4,27.81 9.14,28.07 5.21,28.07 4.7,28.58
POWERINB on Top Layer: 33.78,38.73 34.16,39.12 38.48,39.12 38.86,38.73 38.86,32.89 38.48,32.51 34.67,32.51 34.29,32.89 34.29,33.53 33.78,34.04
POWERINB on Inner2: 33.91,35.94 36.15,35.94 36.44,35.65 36.44,19.03 36.13,18.72 10.37,18.72 9.53,19.56 9.53,19.94 9.4,20.07 9.4,29.21 10.29,30.1 32.77,30.1 33.6,30.94 33.6,35.63
PWRGND on Top Layer: 0,18.34 8.94,18.34 9.4,18.8 9.4,25.91 12.19,28.7 38.48,28.7 39.12,29.34 39.12,50.95 40.74,52.58 68.83,52.58 69.72,51.69 69.72,0.78 68.97,0.03 0.61,0.03 0,0.64
PWRGND on Bottom Layer: 0,18.34 8.94,18.34 9.4,18.8 9.4,25.91 12.19,28.7 38.48,28.7 39.12,29.34 39.12,50.95 40.74,52.58 69.22,52.58 69.72,52.07 69.72,0.78 68.97,0.03 0.61,0.03 0,0.64
PWRGND on Inner1: 0,18.34 8.94,18.34 9.4,18.8 9.4,25.91 12.19,28.7 38.48,28.7 39.12,29.34 39.12,50.95 40.74,52.58 59.31,52.58 59.82,52.07 59.82,0.78 59.06,0.03 0.61,0.03 0,0.64
VDIN on Inner2: 2.03,40.26 2.79,41.02 6.6,41.02 8.64,43.05 26.92,43.05 27.18,42.8 27.18,40.51 26.92,40.26 14.35,40.26 9.91,35.81 2.79,35.81 2.03,36.58
VDRV on Top Layer: 28.32,39.12 28.45,39.24 30.1,39.24 30.23,39.12 30.23,37.72 30.1,37.59 28.45,37.59 28.32,37.72
VDRV on Inner2: 2.03,34.92 2.67,35.56 13.59,35.56 16.13,38.1 27.9,38.1 28.31,38.52 28.31,45.09 27.56,45.85 23.75,45.85 23.24,46.36 23.24,50.91 23.5,51.17 32.39,51.17 32.64,50.93 32.64,35.81 31.82,34.99 19.7,34.99 15.06,30.35 2.67,30.35 2.03,30.99
$1N1810 on Top Layer: 25.17,34.7 25.65,35.18 25.65,37.47 25.78,37.59 28.32,37.59 28.96,36.96 28.96,35.18 27.69,33.91 27.69,33.27 27.43,33.02 25.38,33.02 25.17,33.23
$1N1851 on Top Layer: 29.75,31.5 29.87,31.62 32.29,31.62 32.41,31.5 32.41,29.08 32.29,28.96 31.14,28.96 31.02,29.08 31.02,30.1 30.89,30.23 29.87,30.23 29.75,30.35
$1N1854 on Top Layer: 15.75,31.5 15.88,31.62 18.29,31.62 18.41,31.5 18.41,29.08 18.29,28.96 17.15,28.96 17.02,29.08 17.02,30.1 16.89,30.23 15.88,30.23 15.75,30.35
$1N9211 on Top Layer: 15.54,31.79 15.88,32.13 15.88,33.53 15.75,33.66 14.22,33.66 14.1,33.53 14.1,30.35 14.22,30.23 15.37,30.23 15.54,30.4
$1N9248 on Top Layer: 31.44,33.4 31.57,33.53 33.98,33.53 34.11,33.4 34.11,30.73 33.98,30.61 32.71,30.61 32.58,30.73 32.58,31.88 32.46,32 31.57,32 31.44,32.13
$1N9324 on Top Layer: 30.33,39.22 30.48,39.37 33.27,39.37 33.66,38.99 33.66,35.18 33.27,34.8 31.62,34.8 31.37,35.05 31.37,36.7 30.99,37.08 30.64,37.08 30.33,37.39 30.33,39.22

Small or netless copper shapes (teardrops, artwork), in the pictures only: 54 on Top Layer, 10 on Bottom Layer, 3 on Inner1, 20 on Inner2

## Text on the board
Top Silkscreen Layer: H | L | G
